# Altium schematic sheet MCU.SchDoc
size A
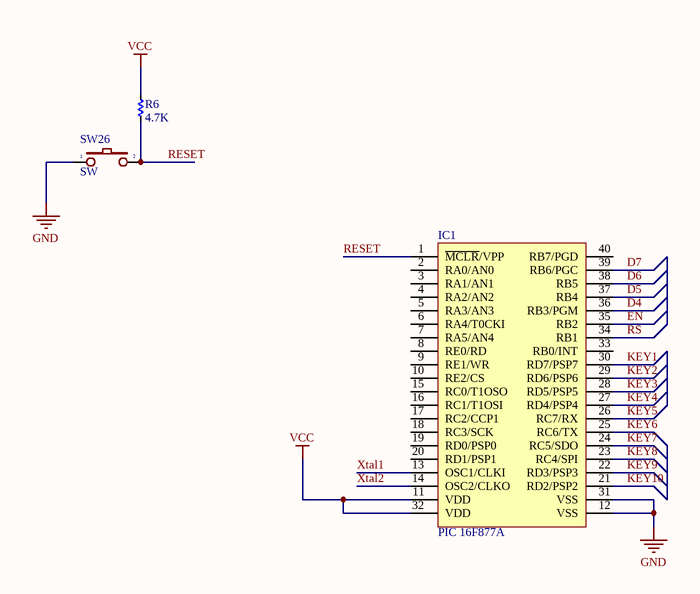
[diagram p0: MCU.SchDoc]

## Parts
IC1  PIC 16F877A  [DIP40/W0.6]
R6  4.7K  [RES-1/2W]
SW26  SW  [SW-DIP1-1]

## Nets
GND: IC1.12(VSS) IC1.31(VSS) SW26.1
VCC: IC1.11(VDD) IC1.32(VDD) R6.1
D4: IC1.36(RB3/PGM)
D5: IC1.37(RB4)
D6: IC1.38(RB5)
D7: IC1.39(RB6/PGC)
EN: IC1.35(RB2)
KEY1: IC1.30(RD7/PSP7)
KEY2: IC1.29(RD6/PSP6)
KEY3: IC1.28(RD5/PSP5)
KEY4: IC1.27(RD4/PSP4)
KEY5: IC1.26(RC7/RX)
KEY6: IC1.25(RC6/TX)
KEY7: IC1.24(RC5/SDO)
KEY8: IC1.23(RC4/SPI)
KEY9: IC1.22(RD3/PSP3)
KEY10: IC1.21(RD2/PSP2)
RESET: IC1.1(~{MCLR}/VPP) R6.2 SW26.2
RS: IC1.34(RB1)
Xtal1: IC1.13(OSC1/CLKI)
Xtal2: IC1.14(OSC2/CLKO)

Not connected (* = marked no-connect by the designer): IC1 2(RA0/AN0) 3(RA1/AN1) 4(RA2/AN2) 5(RA3/AN3) 6(RA4/T0CKI) 7(RA5/AN4) 8(RE0/RD) 9(RE1/WR) 10(RE2/CS) 15(RC0/T1OSO) 16(RC1/T1OSI) 17(RC2/CCP1) 18(RC3/SCK) 19(RD0/PSP0) 20(RD1/PSP1) 33(RB0/INT) 40(RB7/PGD)

## Library data of the parts
IC1 = PIC16F877-PU: 8K FLASH, 368B RAM, 256B EFROM; Value: DIP 40; Value: PIC16F877A; Copyright by: VanDungEvn
R6 = Res: Manufacturer: Generic Components; Class: Passive; SubClass: R; Published: 08/06/2000; Publisher: Altium Hobart Technology Centre
SW26 = SW2: Switch button 2 pin; Value: SW chip 2 pin